# EAGLE design Starter (EAGLE 8.5.2)
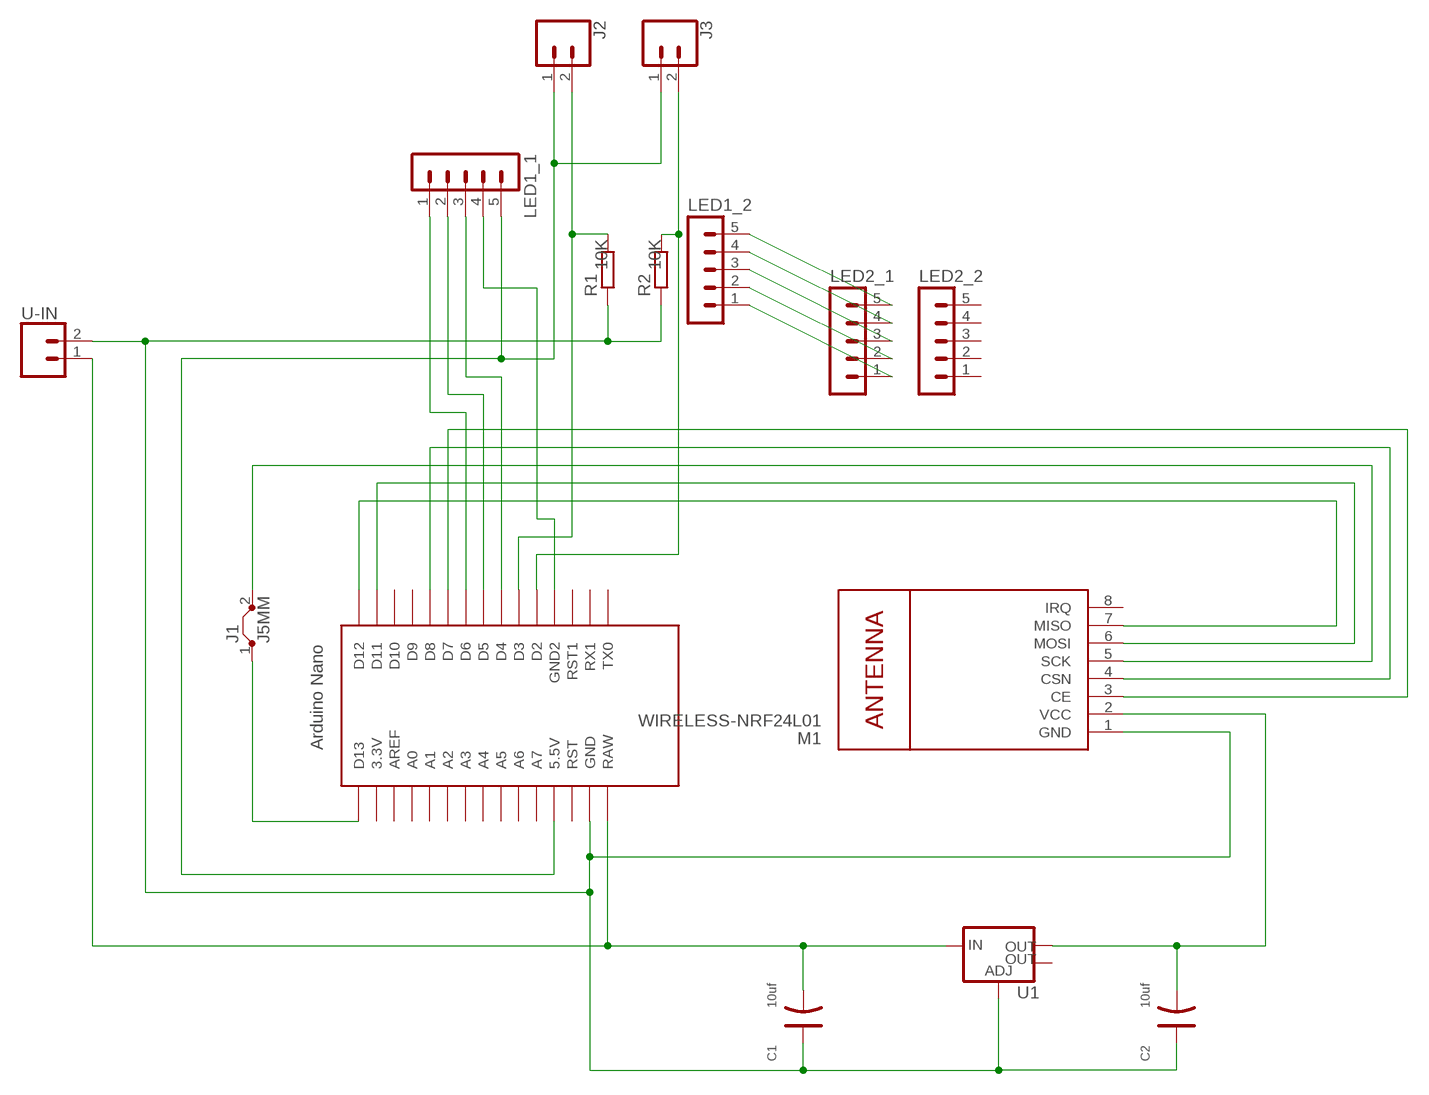
[diagram p0: schematic, sheet 1]

## Parts
C1  10uf  TANTALUM-SMD-10UF-16V-10%(AVX-B)  [AVX-B]
C2  10uf  TANTALUM-SMD-10UF-16V-10%(AVX-B)  [AVX-B]
J1  J5MM  [05]
J2  CONN_025MM  [SCREWTERMINAL-5MM-2]
J3  CONN_025MM  [SCREWTERMINAL-5MM-2]
LED1_1  MA05-1  [MA05-1]
LED1_2  MA05-1  [MA05-1]
LED2_1  MA05-1  [MA05-1]
LED2_2  MA05-1  [MA05-1]
M1  WIRELESS-NRF24L01  [WIRELESS-NRF24L01]
R1  R-EU_0207/12  [0207/12]
R2  R-EU_0207/12  [0207/12]
U1  V_REG_LM1117SOT223  [SOT223]
U$1  NANO  [NANO]
U-IN  CONN_025MM  [SCREWTERMINAL-5MM-2]

## Nets
N$1: M1.4(CSN) U$1.D8
N$2: C1.+ C2.+ M1.1(GND) R1.1 R2.1 U1.1(ADJ) U$1.GND U-IN.2
N$3: C2.- M1.2(VCC) U1.2(OUT)
N$4: J1.2 M1.5(SCK)
N$5: LED1_2.5 LED2_1.5
N$6: LED1_2.4 LED2_1.4
N$7: LED1_2.3 LED2_1.3
N$8: LED1_2.2 LED2_1.2
N$9: LED1_2.1 LED2_1.1
N$10: J2.1 J3.1 LED1_1.5 U$1.5V(5.5V)
N$11: C1.- U1.3(IN) U$1.RAW U-IN.1
N$12: LED1_1.3 U$1.D4
N$13: LED1_1.2 U$1.D5
N$14: LED1_1.1 U$1.D6
N$15: M1.3(CE) U$1.D7
N$16: M1.6(MOSI) U$1.D11
N$17: M1.7(MISO) U$1.D12
N$18: J2.2 R1.2 U$1.D3
N$19: J3.2 R2.2 U$1.D2
N$20: LED1_1.4 U$1.GND1(GND2)
N$21: J1.1 U$1.D13
Unconnected: LED2_2.1 LED2_2.2 LED2_2.3 LED2_2.4 LED2_2.5 M1.8(IRQ) U1.4(OUT) U$1.3.3V U$1.A0 U$1.A1 U$1.A2 U$1.A3 U$1.A4 U$1.A5 U$1.A6 U$1.A7 U$1.AREF U$1.D9 U$1.D10 U$1.ICSP1 U$1.ICSP2 U$1.ICSP3 U$1.ICSP4 U$1.ICSP5 U$1.ICSP6 U$1.RST U$1.RST1 U$1.RX1 U$1.TX0

## Library data of the parts
C1 C2 = Seeed-Capacitor:TANTALUM-SMD-10UF-16V-10%(AVX-B): 302020019; MPN: TAJB106K016RNJ
J1 = jumper:J: Bridge
J2 J3 U-IN = SparkFun-Connectors:CONN_02: Multi connection point. Often used as Generic Header-pin footprint for 0.1 inch spaced/style header connections On any of the 0.1 inch spaced packages, you can populate with these: Break Away Headers - Straight <https://www.sparkfun.com/products/116> (PRT-00116) Break Away Male Headers - Right Angle <https://www.sparkfun.com/products/553> (PRT-00553) Female Headers <https://www.sparkfun.com/products/115> (PRT-00115) Break Away Headers - Machine Pin <https://www.sparkfun.com/products/117> (PRT-00117) Break Away Female Headers - Swiss Machine Pin <https://www.sparkfun.com/products/743> (PRT-00743) For SCREWTERMINALS and SPRING TERMINALS visit here: Screw Terimnals on SparkFun.com <https://www.sparkfun.com/search/results?term=Screw+Terminals> (5mm/3.5mm/2.54mm spacing) This device is also useful as a general connection point to wire up your design to another part of your project. Our various solder wires solder well into these plated through hole pads. Hook-Up Wire - Assortment (Stranded, 22 AWG) <https://www.sparkfun.com/products/11375> (PRT-11375) Hook-Up Wire - Assortment (Solid Core, 22 AWG) <https://www.sparkfun.com/products/11367> (PRT-11367) View the entire wire category on our website here <https://www.sparkfun.com/categories/141> Special notes: Molex polarized connector foot print use with: PRT-08233 with associated crimp pins and housings. 2.54_SCREWTERM for use with PRT-10571. 3.5mm Screw Terminal footprints for PRT-08084 5mm Screw Terminal footprints for use with PRT-08432; SF_SKU: PRT-08432
LED1_1 LED1_2 LED2_1 LED2_2 = con-lstb:MA05-1: PIN HEADER; OC_FARNELL: unknown; OC_NEWARK: unknown
M1 = diy-modules:WIRELESS-NRF24L01: 2.4 GHz Wireless Module based on NRF24L01 chip More details available here: http://www.electrodragon.com/w/NRF24L01 Click here to find device on ebay.com <http://www.ebay.com/sch/nrf24l01+arduino>
R1 R2 = resistor:R-EU_: RESISTOR, European symbol; R: 10K
U1 = SparkFun-IC-Power:V_REG_LM1117: Voltage Regulator LM1117 Standard adjustable voltage regulator but in SMD form. Spark Fun Electronics SKU : COM-00595; PROD_ID: VREG-08170
U$1 = Arduino-clone:NANO: Arduino Nano

## Board
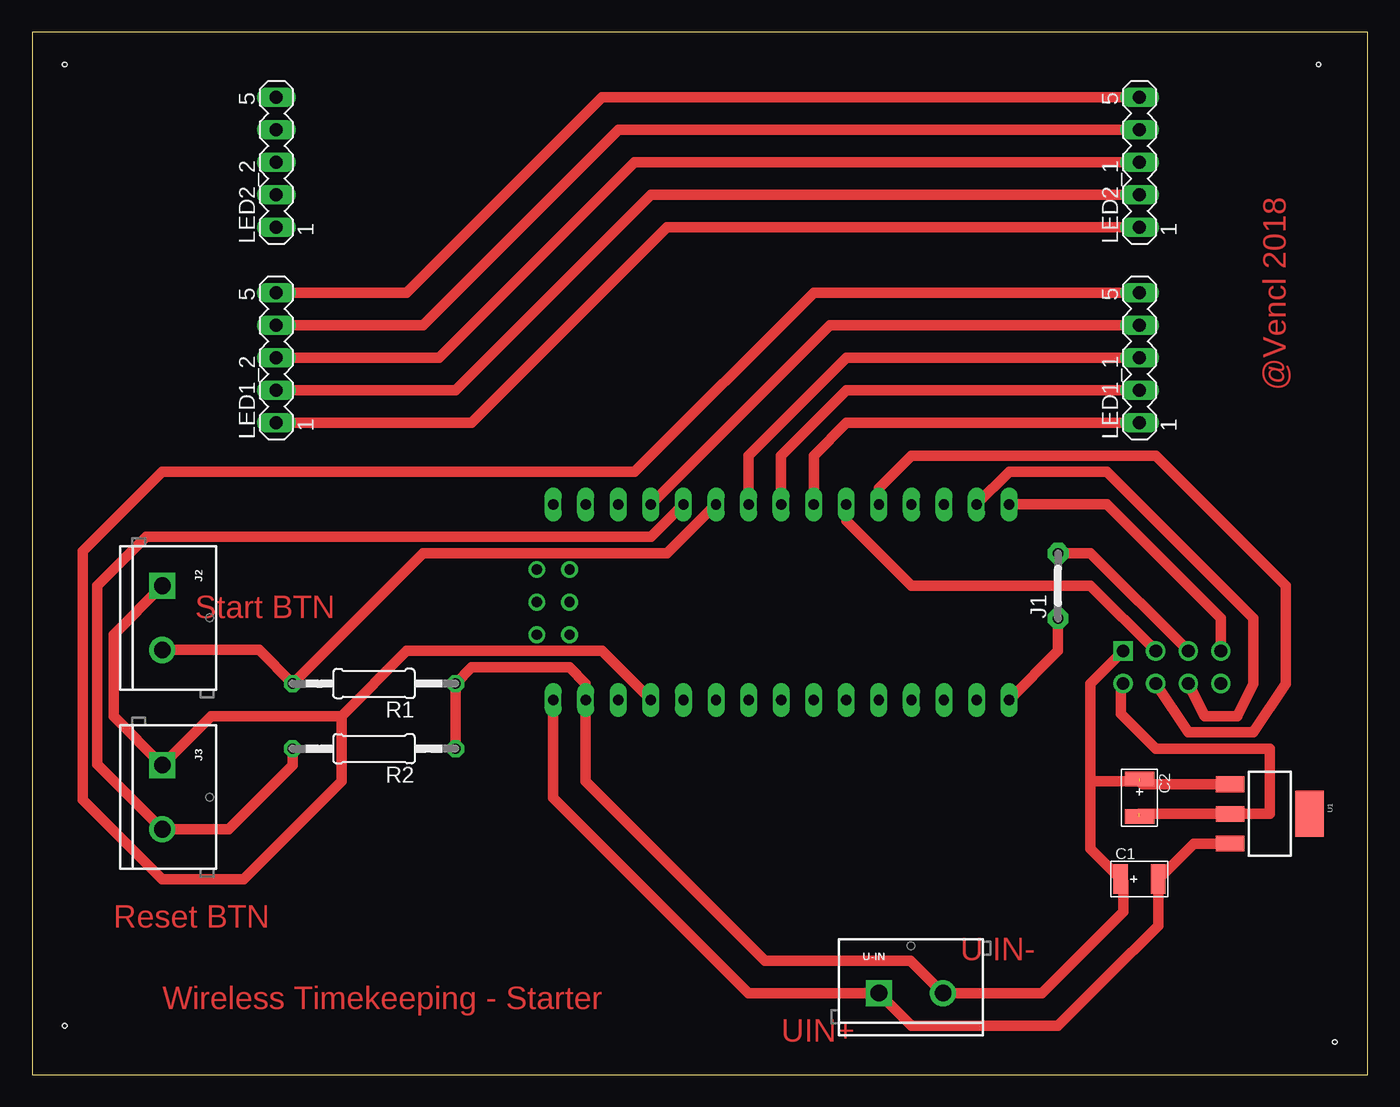
[diagram p1: board, top side]
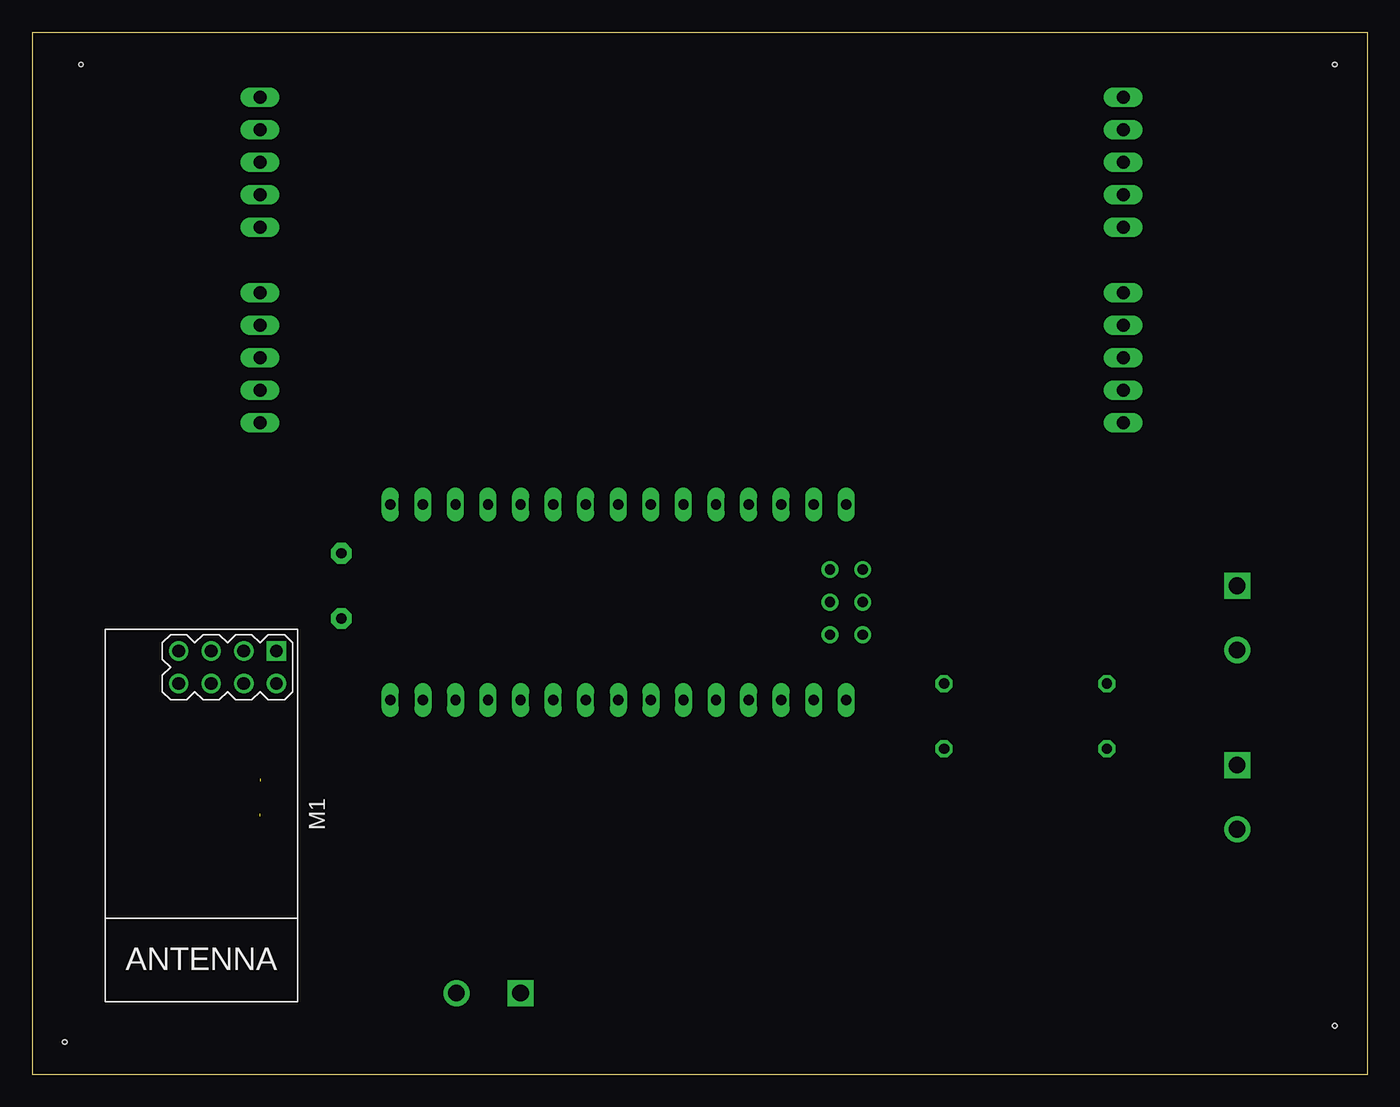
[diagram p2: board, bottom side, seen from below]

Size 104.14 x 81.27 mm. Coordinates in mm from the lower left corner, seen from the top.
Outline: 0,0 104.14,0 104.14,81.27 0,81.27 0,0
Copper layers (1*16): Top 0.035mm / dielectric 1.5mm / Bottom 0.035mm
Design rules "default": minimum track width 6mil, minimum drill 0.35mm, track to track 6mil, track to pad 6mil, pad to pad 6mil, via to via 6mil, smd to smd 6mil, copper to edge 40mil, drill to drill 6mil, minimum pad ring 10mil, minimum via ring 8mil, stop-mask expansion 4mil, vias tented up to drill 0mil, thermal gap 10mil
Holes 0.35 mm at 2.54,3.81 2.54,78.74 100.33,78.74 101.6,2.54

### Footprints (pad centres in the part's own frame; a part is rotated, then mirrored left to right if it is on the bottom)
AVX-B = smd 1.143 x 2.286: + -1.46,0; - 1.46,0
05 = drill 0.813 pad 1.6 octagon: 1 -2.54,0; 2 2.54,0
SCREWTERMINAL-5MM-2 = drill 1.3 pad 2.032 square: 1 0,0 | drill 1.3 pad 2.032: 2 5,0
MA05-1 = drill 1.016 long: 1 -5.08,0; 2 -2.54,0; 3 0,0; 4 2.54,0; 5 5.08,0
WIRELESS-NRF24L01 = drill 1 square: 1 -12.7,6.35 | drill 1: 2 -10.16,6.35; 3 -12.7,3.81; 4 -10.16,3.81; 5 -12.7,1.27; 6 -10.16,1.27; 7 -12.7,-1.27; 8 -10.16,-1.27
0207/12 = drill 0.813 octagon: 1 -6.35,0; 2 6.35,0
SOT223 = smd 1.219 x 2.235: 1 -2.311,-3.099; 2 0,-3.099; 3 2.311,-3.099 | smd 3.6 x 2.2: 4 0,3.099
NANO = drill 0.8 long: 3.3V -10.16,24.13; 5V -10.16,-1.27; A0 -10.16,19.05; A1 -10.16,16.51; A2 -10.16,13.97; A3 -10.16,11.43; A4 -10.16,8.89; A5 -10.16,6.35; A6 -10.16,3.81; A7 -10.16,1.27; AREF -10.16,21.59; D2 5.08,1.27; D3 5.08,3.81; D4 5.08,6.35; D5 5.08,8.89; D6 5.08,11.43; D7 5.08,13.97; D8 5.08,16.51; D9 5.08,19.05; D10 5.08,21.59; D11 5.08,24.13; D12 5.08,26.67; D13 -10.16,26.67; GND -10.16,-6.35; GND1 5.08,-1.27; RAW -10.16,-8.89; RST -10.16,-3.81; RST1 5.08,-3.81; RX1 5.08,-6.35; TX0 5.08,-8.89 | drill 0.8: ICSP1 -5.08,-10.16; ICSP2 -5.08,-7.62; ICSP3 -2.54,-10.16; ICSP4 -2.54,-7.62; ICSP5 0,-10.16; ICSP6 0,-7.62

### Placement (x,y rotation side)
C1  86.36,15.24 0 top
C2  86.36,21.59 270 top
J1  80.01,38.1 90 top
J2  10.16,38.1 270 top
J3  10.16,24.13 270 top
LED1_1  86.36,55.88 90 top
LED1_2  19.05,55.88 90 top
LED2_1  86.36,71.12 90 top
LED2_2  19.05,71.12 90 top
M1  91.44,20.32 270 bottom
R1  26.67,30.48 180 top
R2  26.67,25.4 180 top
U1  96.52,20.32 270 top
U$1  49.53,39.37 90 bottom
U-IN  66.04,6.35 0 top

### Tracks (layer width: path | path; a pad name or v marks a point on that pad's centre or on a via)
N$1
  Top 0.406: 66.04,45.72 U$1.D8
  Top 0.813: M1.4 90.17,26.67 95.25,26.67 97.79,30.48 97.79,38.1 87.63,48.26 68.58,48.26 66.04,45.72
N$2  (1 unrouted)
  Top 0.406: U$1.GND 43.18,30.48
  Top 0.813: U$1.GND 43.18,22.86 57.15,8.89 68.5,8.89 U-IN.2 78.74,6.35 85.09,12.7 85.09,15.05 C1.+ 82.55,17.59 82.55,22.86 | 43.18,30.48 41.91,31.75 34.29,31.75 R1.1 R2.1 | M1.1 82.55,30.48 82.55,22.86 | U1.1 86.59,22.63 86.36,22.86 | C2.+ 86.17,22.86 82.55,22.86
N$3  (1 unrouted)
  Top 0.813: M1.2 84.9,30.48 84.9,28.13 87.63,25.4 96.52,25.4 96.52,20.32 U1.2 86.36,20.32
N$4
  Top 0.813: J1.2 82.55,40.64 M1.5
N$5
  Top 0.813: LED1_2.5 29.21,60.96 44.45,76.2 LED2_1.5
N$6
  Top 0.813: LED1_2.4 30.48,58.42 45.72,73.66 LED2_1.4
N$7
  Top 0.813: LED1_2.3 31.75,55.88 46.99,71.12 LED2_1.3
N$8
  Top 0.813: LED1_2.2 33.02,53.34 48.26,68.58 LED2_1.2
N$9
  Top 0.813: LED1_2.1 34.29,50.8 49.53,66.04 LED2_1.1
N$10
  Top 0.813: J2.1 6.35,34.29 6.35,27.94 J3.1 13.97,27.94 24.13,27.94 | U$1.5V 44.45,33.02 29.21,33.02 24.13,27.94 | LED1_1.5 60.96,60.96 46.99,46.99 10.16,46.99 3.96,40.79 3.96,21.44 10.16,15.24 16.51,15.24 24.13,22.86 24.13,27.94
N$11
  Top 0.813: U1.3 90.59,18.01 C1.- 87.82,11.62 83.82,7.62 82.55,6.35 80.01,3.81 68.58,3.81 U-IN.1 55.88,6.35 40.64,21.59 U$1.RAW
N$12
  Top 0.813: LED1_1.3 63.5,55.88 55.88,48.26 U$1.D4
N$13
  Top 0.813: U$1.D5 58.42,48.26 63.5,53.34 LED1_1.2
N$14
  Top 0.813: LED1_1.1 80.01,50.8 63.5,50.8 60.96,48.26 U$1.D6
N$15
  Top 0.406: 63.5,43.18 U$1.D7
  Top 0.813: M1.3 82.55,38.1 68.58,38.1 63.5,43.18
N$16
  Top 0.813: M1.6 91.44,27.94 93.98,27.94 95.25,30.48 95.25,35.56 83.82,46.99 76.2,46.99 U$1.D11
N$17
  Top 0.813: M1.7 92.71,35.56 83.82,44.45 U$1.D12
N$18
  Top 0.813: J2.2 17.7,33.1 R1.2 30.48,40.64 49.53,40.64 U$1.D3
N$19
  Top 0.813: R2.2 20.32,24.13 15.32,19.13 J3.2 5.08,24.21 5.08,38.1 8.89,41.91 48.26,41.91 U$1.D2
N$20
  Top 0.813: LED1_1.4 62.23,58.42 U$1.GND1
N$21
  Top 0.813: U$1.D13 80.01,33.02 J1.1

### Text on the board
Top: @Vencl 2018 | Start BTN | Reset BTN | U IN- | Wireless Timekeeping - Starter | UIN+